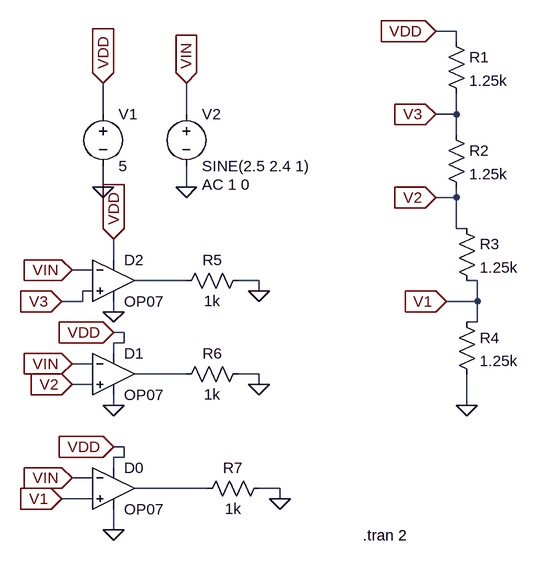
[diagram p0: schematic 2bit_adc.asc]
2bit_adc.asc, the LTspice schematic file:
Version 4.1
SHEET 1 880 728
WIRE 560 -64 528 -64
WIRE 560 -48 560 -64
WIRE 16 64 16 16
WIRE 144 64 144 16
WIRE 560 64 560 32
WIRE 560 64 528 64
WIRE 560 96 560 64
WIRE 16 176 16 144
WIRE 144 176 144 144
WIRE 560 192 560 176
WIRE 560 192 528 192
WIRE 560 240 560 192
WIRE 576 240 560 240
WIRE 32 288 32 256
WIRE 0 304 -32 304
WIRE 144 320 64 320
WIRE 256 320 224 320
WIRE 592 320 576 320
WIRE 0 336 -16 336
WIRE 256 336 256 320
WIRE -16 352 -16 336
WIRE -16 352 -48 352
WIRE 592 352 592 320
WIRE 592 352 544 352
WIRE 32 368 32 352
WIRE 592 384 592 352
WIRE 592 384 576 384
WIRE 48 400 32 400
WIRE 48 416 48 400
WIRE 48 416 32 416
WIRE 32 432 32 416
WIRE 0 448 -32 448
WIRE 144 464 64 464
WIRE 256 464 224 464
WIRE 0 480 -32 480
WIRE 256 480 256 464
WIRE 32 512 32 496
WIRE 576 512 576 464
WIRE 48 576 32 576
WIRE 48 592 48 576
WIRE 48 592 32 592
WIRE 32 608 32 592
WIRE 0 624 -32 624
WIRE 176 640 64 640
WIRE 288 640 256 640
WIRE 0 656 -48 656
WIRE 288 656 288 640
WIRE 32 704 32 672
FLAG 16 16 VDD
IOPIN 16 16 In
FLAG 144 16 VIN
IOPIN 144 16 In
FLAG 528 -64 VDD
IOPIN 528 -64 In
FLAG 576 512 0
FLAG 528 64 V3
IOPIN 528 64 In
FLAG 528 192 V2
IOPIN 528 192 In
FLAG 544 352 V1
IOPIN 544 352 In
FLAG -32 304 VIN
IOPIN -32 304 In
FLAG -32 448 VIN
IOPIN -32 448 In
FLAG -32 624 VIN
IOPIN -32 624 In
FLAG -48 352 V3
IOPIN -48 352 In
FLAG -32 480 V2
IOPIN -32 480 In
FLAG -48 656 V1
IOPIN -48 656 In
FLAG 32 256 VDD
IOPIN 32 256 In
FLAG 32 400 VDD
IOPIN 32 400 In
FLAG 32 576 VDD
IOPIN 32 576 In
FLAG 16 176 0
FLAG 144 176 0
FLAG 32 368 0
FLAG 32 512 0
FLAG 32 704 0
FLAG 288 656 0
FLAG 256 480 0
FLAG 256 336 0
SYMBOL voltage 16 48 R0
WINDOW 123 0 0 Left 0
WINDOW 39 0 0 Left 0
SYMATTR InstName V1
SYMATTR Value 5
SYMBOL voltage 144 48 R0
WINDOW 123 24 124 Left 2
WINDOW 39 0 0 Left 0
SYMATTR InstName V2
SYMATTR Value SINE(2.5 2.4 1)
SYMATTR Value2 AC 1 0
SYMBOL res 544 -64 R0
SYMATTR InstName R1
SYMATTR Value 1.25k
SYMBOL res 544 80 R0
SYMATTR InstName R2
SYMATTR Value 1.25k
SYMBOL res 560 224 R0
SYMATTR InstName R3
SYMATTR Value 1.25k
SYMBOL res 560 368 R0
SYMATTR InstName R4
SYMATTR Value 1.25k
SYMBOL OpAmps\\OP07 32 256 R0
SYMATTR InstName D2
SYMBOL OpAmps\\OP07 32 400 R0
SYMATTR InstName D1
SYMBOL OpAmps\\OP07 32 576 R0
SYMATTR InstName D0
SYMBOL res 240 304 R90
WINDOW 0 0 56 VBottom 2
WINDOW 3 32 56 VTop 2
SYMATTR InstName R5
SYMATTR Value 1k
SYMBOL res 240 448 R90
WINDOW 0 0 56 VBottom 2
WINDOW 3 32 56 VTop 2
SYMATTR InstName R6
SYMATTR Value 1k
SYMBOL res 272 624 R90
WINDOW 0 0 56 VBottom 2
WINDOW 3 32 56 VTop 2
SYMATTR InstName R7
SYMATTR Value 1k
TEXT 416 712 Left 2 !.tran 2

The netlist it stands for:
* 2bit_adc.asc
V1 VDD 0 5
V2 VIN 0 SINE(2.5 2.4 1) AC 1 0
R1 VDD V3 1.25k
R2 V3 V2 1.25k
R3 V2 V1 1.25k
R4 V1 0 1.25k
X§D2 V3 VIN VDD 0 N001 LT1001  ; OP07, pins In+ In- V+ V- OUT
X§D1 V2 VIN VDD 0 N002 LT1001  ; OP07, pins In+ In- V+ V- OUT
X§D0 V1 VIN VDD 0 N003 LT1001  ; OP07, pins In+ In- V+ V- OUT
R5 0 N001 1k
R6 0 N002 1k
R7 0 N003 1k
.tran 2
.lib LTC.lib
.backanno
.end